# EAGLE design Minimum-System (EAGLE 6.3)
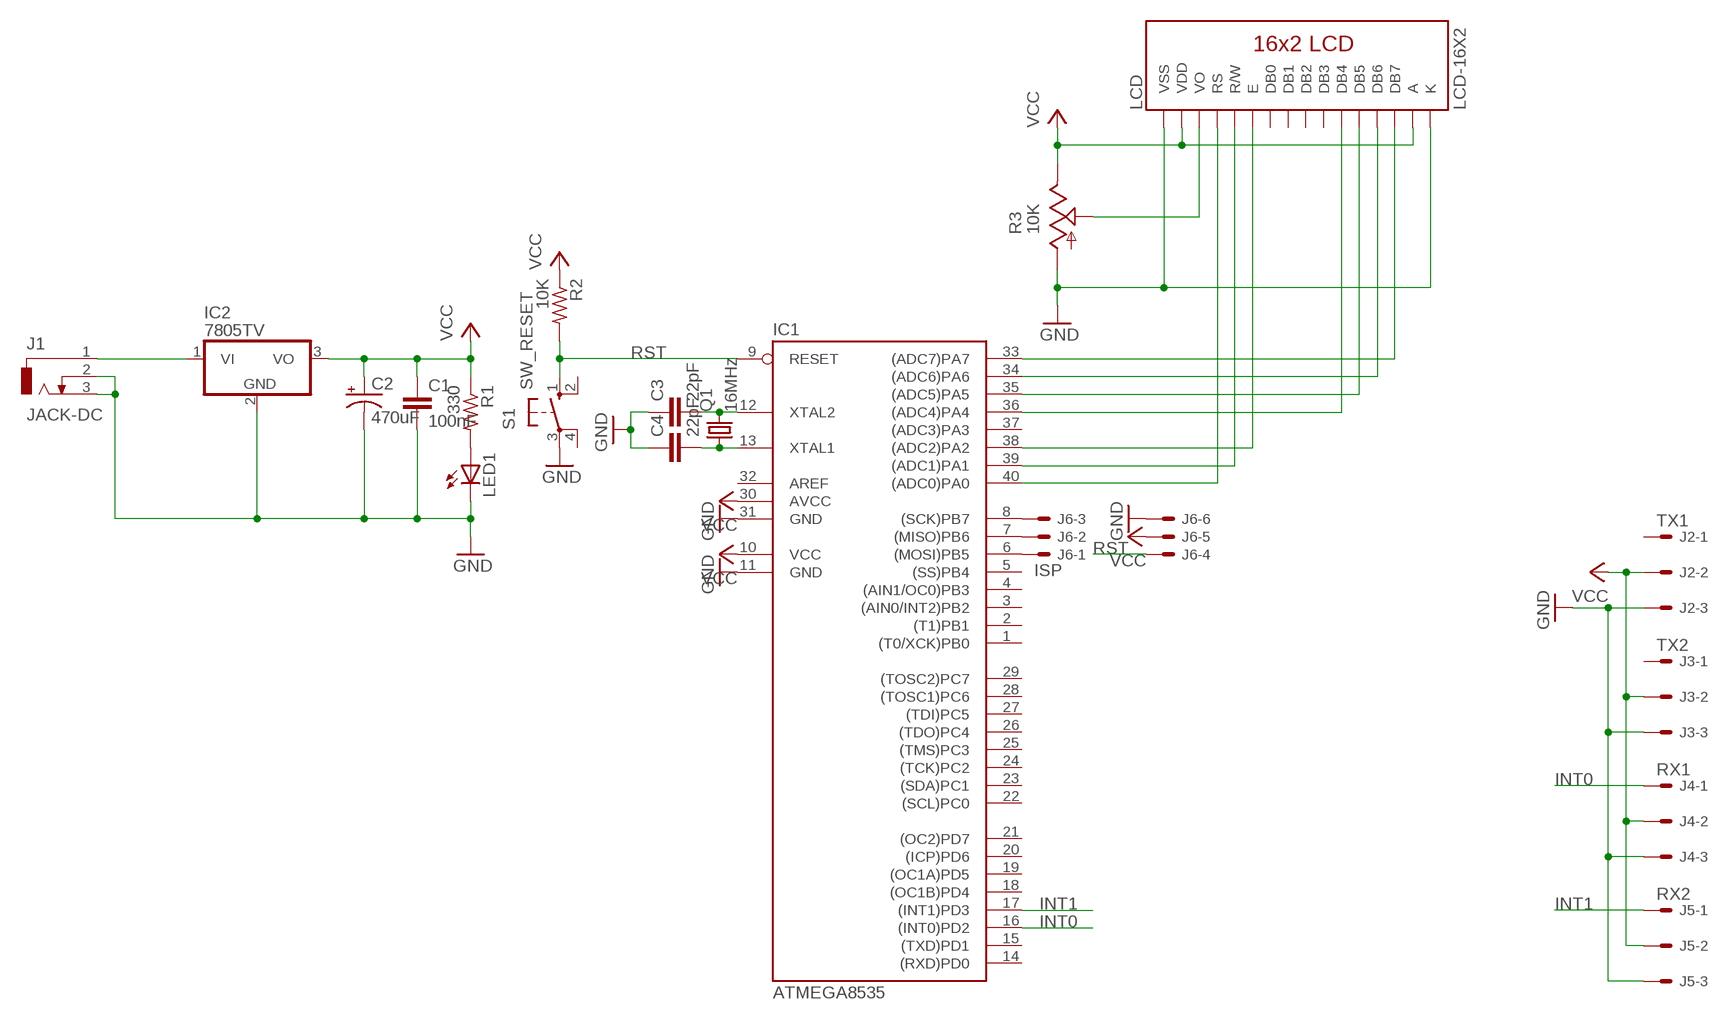
[diagram p0: schematic, sheet 1]

## Parts
C1  100nF  CAPACITOR-NONPOLAR025-024X044  [C025-024X044]
C2  470uF  CAPACITOR-POLARE2.5-6  [E2,5-6]
C3  22pF  CAPACITOR-NONPOLAR025-024X044  [C025-024X044]
C4  22pF  CAPACITOR-NONPOLAR025-024X044  [C025-024X044]
IC1  ATMEGA8535  ATMEGA8535/16/32  [DIL40]
IC2  7805TV  [TO220V]
J1  JACK-DC  [DCJ0202]
J2  TX1  CON_MOLEX-05-7038-03  [7395-03]
J3  TX2  CON_MOLEX-05-7038-03  [7395-03]
J4  RX1  CON_MOLEX-05-7038-03  [7395-03]
J5  RX2  CON_MOLEX-05-7038-03  [7395-03]
J6  ISP  CON_MOLEX-27-2061-06  [6410-06]
LCD  LCD-16X2  [LCD-16X2]
LED1  LED3MM  [LED3MM]
Q1  16MHz  CRYSTALHC49S  [HC49/S]
R1  330  RESISTOR0204/7  [0204/7]
R2  10K  RESISTOR0204/7  [0204/7]
R3  10K  TRIMPOTCA6V  [CA6V]
S1  SW_RESET  SW-PUSHBUTTON  [B3F-10XX]

## Nets
GND [pwr]: C1.2 C2.- C3.1 C4.1 IC1.11(GND) IC1.31(GND) IC2.2(GND) J1.2 J1.3 J2.3 J3.3 J4.3 J5.3 J6.6 LCD.1(VSS) LCD.16(K) LED1.K(C) R3.A S1.3(P)
INT0: IC1.16((INT0)PD2) J4.1
INT1: IC1.17((INT1)PD3) J5.1
N$1: LED1.A R1.2
N$2: IC1.34((ADC6)PA6) LCD.13(DB6)
N$3: IC1.33((ADC7)PA7) LCD.14(DB7)
N$4 [pwr]: IC2.1(VI) J1.1
N$5: C3.2 IC1.12(XTAL2) Q1.2
N$6: C4.2 IC1.13(XTAL1) Q1.1
N$7: LCD.3(VO) R3.S
N$9: IC1.40((ADC0)PA0) LCD.4(RS)
N$10: IC1.39((ADC1)PA1) LCD.5(R/W)
N$11: IC1.38((ADC2)PA2) LCD.6(E)
N$12: IC1.36((ADC4)PA4) LCD.11(DB4)
N$13: IC1.35((ADC5)PA5) LCD.12(DB5)
N$14: IC1.6((MOSI)PB5) J6.1
N$15: IC1.7((MISO)PB6) J6.2
N$16: IC1.8((SCK)PB7) J6.3
RST: IC1.9(RESET) J6.4 R2.2 S1.1(S)
VCC [pwr]: C1.1 C2.+ IC1.10(VCC) IC1.30(AVCC) IC2.3(VO) J2.2 J3.2 J4.2 J5.2 J6.5 LCD.2(VDD) LCD.15(A) R1.1 R2.1 R3.E
Unconnected: IC1.1((T0/XCK)PB0) IC1.2((T1)PB1) IC1.3((AIN0/INT2)PB2) IC1.4((AIN1/OC0)PB3) IC1.5((SS)PB4) IC1.14((RXD)PD0) IC1.15((TXD)PD1) IC1.18((OC1B)PD4) IC1.19((OC1A)PD5) IC1.20((ICP)PD6) IC1.21((OC2)PD7) IC1.22((SCL)PC0) IC1.23((SDA)PC1) IC1.24((TCK)PC2) IC1.25((TMS)PC3) IC1.26((TDO)PC4) IC1.27((TDI)PC5) IC1.28((TOSC1)PC6) IC1.29((TOSC2)PC7) IC1.32(AREF) IC1.37((ADC3)PA3) J2.1 J3.1 LCD.7(DB0) LCD.8(DB1) LCD.9(DB2) LCD.10(DB3) S1.2(S1) S1.4(P1)

## Library data of the parts
C1 C3 C4 = barelang-store:CAPACITOR-NONPOLAR: CAPACITOR, European symbol
C2 = barelang-store:CAPACITOR-POLAR: POLARIZED CAPACITOR, American symbol
IC1 = barelang-store:ATMEGA8535/16/32: MICROCONTROLLER 32 Kbytes FLASH 2 Kbytes SRAM 1 Kbytes EEPROM USART 8-channel 10 bit ADC Source: www.atmel.com .. doc2503.pdf; MPN: ATMEGA32-16PU; OC_FARNELL: 1661729; OC_NEWARK: 51P1794
IC2 = linear:78*: Positive VOLTAGE REGULATOR Source: http://cache.national.com/ds/LM/LM78L05.pdf http://www.fairchildsemi.com/ds/LM/LM7805.pdf
J1 = barelang-store:JACK-DC: DC POWER JACK Source: DCJ0202.pdf; OC_FARNELL: unknown; OC_NEWARK: unknown
J2-J5 = barelang-store:CON_MOLEX-?-03: CONNECTOR wire to board 2.54 mm (.1 inch) pitch header; OC_FARNELL: unknown; OC_NEWARK: unknown
J6 = barelang-store:CON_MOLEX-?-06: CONNECTOR wire to board 2.54 mm (.1 inch) pitch header; OC_FARNELL: unknown; OC_NEWARK: unknown
LCD = barelang-store:LCD-16X2
LED1 = barelang-store:LED: LED OSRAM: - CHIPLED LG R971, LG N971, LY N971, LG Q971, LY Q971, LO R971, LY R971 LH N974, LH R974 LS Q976, LO Q976, LY Q976 LO Q996 - Hyper CHIPLED LW Q18S LB Q993, LB Q99A, LB R99A - SideLED LS A670, LO A670, LY A670, LG A670, LP A670 LB A673, LV A673, LT A673, LW A673 LH A674 LY A675 LS A676, LA A676, LO A676, LY A676, LW A676 LS A679, LY A679, LG A679 - Hyper Micro SIDELED® LS Y876, LA Y876, LO Y876, LY Y876 LT Y87S - SmartLED LW L88C, LW L88S LB L89C, LB L89S, LG L890 LS L89K, LO L89K, LY L89K LS L896, LA L896, LO L896, LY L896 - TOPLED LS T670, LO T670, LY T670, LG T670, LP T670 LSG T670, LSP T670, LSY T670, LOP T670, LYG T670 LG T671, LOG T671, LSG T671 LB T673, LV T673, LT T673, LW T673 LH T674 LS T676, LA T676, LO T676, LY T676, LB T676, LH T676, LSB T676, LW T676 LB T67C, LV T67C, LT T67C, LS T67K, LO T67K, LY T67K, LW E67C LS E67B, LA E67B, LO E67B, LY E67B, LB E67C, LV E67C, LT E67C LW T67C LS T679, LY T679, LG T679 LS T770, LO T770, LY T770, LG T770, LP T770 LB T773, LV T773, LT T773, LW T773 LH T774 LS E675, LA E675, LY E675, LS T675 LS T776, LA T776, LO T776, LY T776, LB T776 LHGB T686 LT T68C, LB T68C - Hyper Mini TOPLED® LB M676 - Mini TOPLED Santana® LG M470 LS M47K, LO M47K, LY M47K Source: http://www.osram.convergy.de LUXEON: - LUMILED® LXK2-PW12-R00, LXK2-PW12-S00, LXK2-PW14-U00, LXK2-PW14-V00 LXK2-PM12-R00, LXK2-PM12-S00, LXK2-PM14-U00 LXK2-PE12-Q00, LXK2-PE12-R00, LXK2-PE12-S00, LXK2-PE14-T00, LXK2-PE14-U00 LXK2-PB12-K00, LXK2-PB12-L00, LXK2-PB12-M00, LXK2-PB14-N00, LXK2-PB14-P00, LXK2-PB14-Q00 LXK2-PR12-L00, LXK2-PR12-M00, LXK2-PR14-Q00, LXK2-PR14-R00 LXK2-PD12-Q00, LXK2-PD12-R00, LXK2-PD12-S00 LXK2-PH12-R00, LXK2-PH12-S00 LXK2-PL12-P00, LXK2-PL12-Q00, LXK2-PL12-R00 Source: www.luxeon.com KINGBRIGHT: KA-3528ASYC Source: www.kingbright.com
Q1 = barelang-store:CRYSTAL: CRYSTAL; OC_FARNELL: 1667008; OC_NEWARK: unknown
R1 R2 = barelang-store:RESISTOR: RESISTOR, American symbol
R3 = barelang-store:TRIMPOT: POTENTIOMETER
S1 = barelang-store:SW-PUSHBUTTON: OMRON SWITCH; MPN: B3F-1000; OC_FARNELL: 176432; OC_NEWARK: 36M3542

## Net classes
0 default: width 0.4 mm
1 pwr: width 0.5 mm

## Board
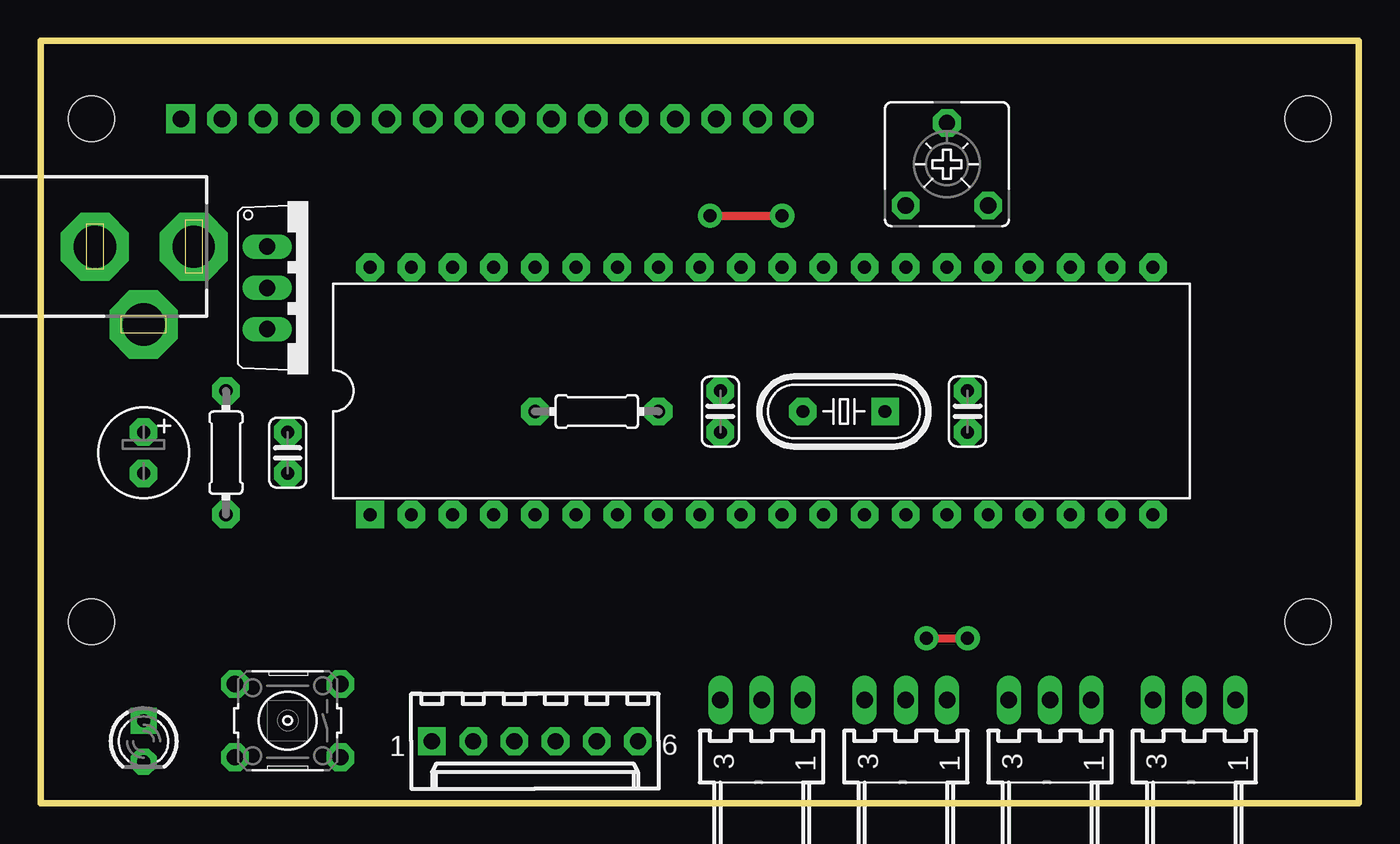
[diagram p1: board, top side]
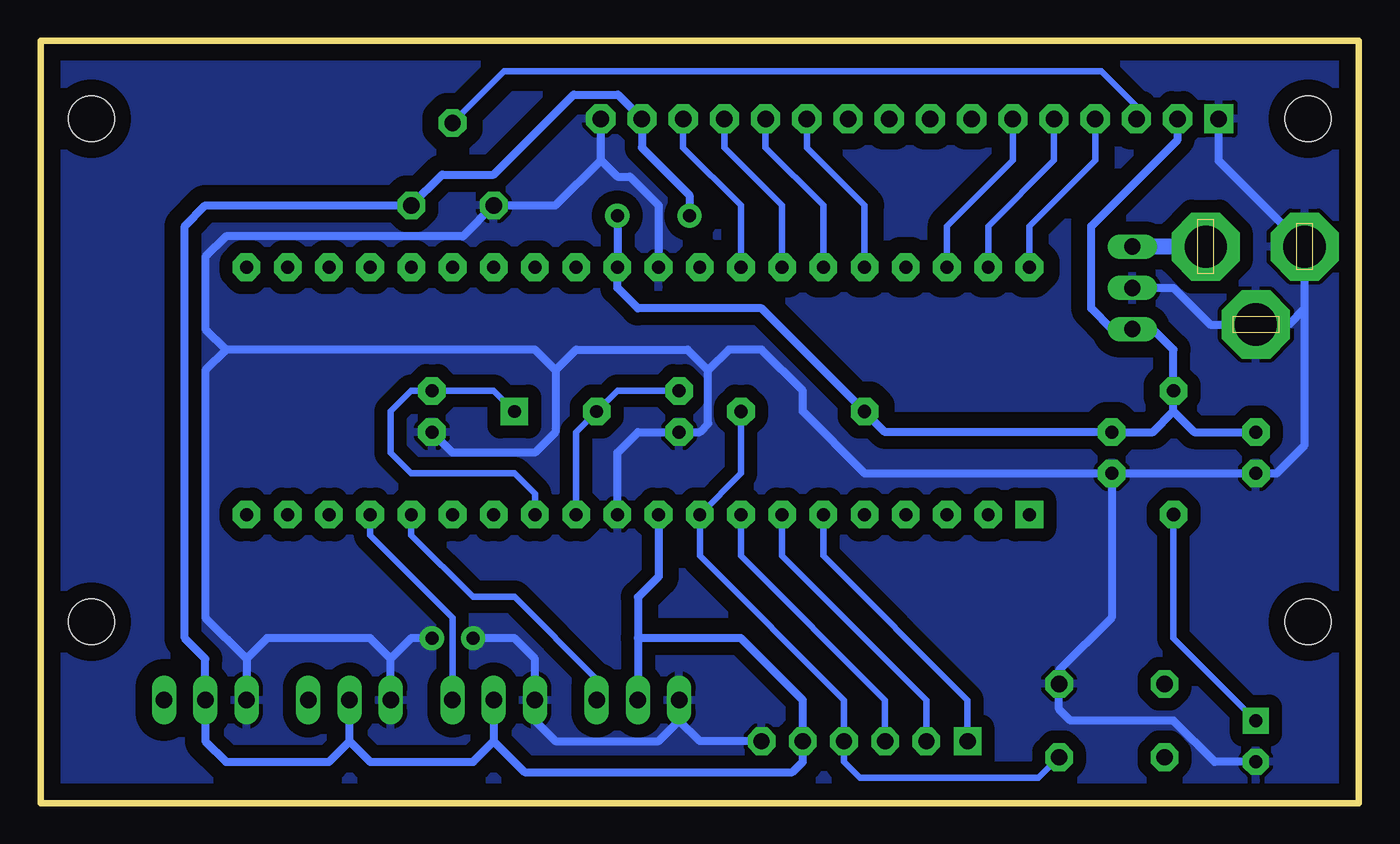
[diagram p2: board, bottom side, seen from below]

Size 81.28 x 46.99 mm. Coordinates in mm from the lower left corner, seen from the top.
Outline: 0,46.99 81.28,46.99 81.28,0 0,0 0,46.99
Copper layers (1*16): Top 0.035mm / dielectric 1.5mm / Bottom 0.035mm
Design rules "default": minimum track width 10mil, minimum drill 24mil, track to track 8mil, track to pad 8mil, pad to pad 8mil, via to via 8mil, smd to smd 8mil, copper to edge 40mil, drill to drill 8mil, minimum pad ring 10mil, minimum via ring 8mil, stop-mask expansion 4mil, vias tented up to drill 0mil, thermal gap 10mil

### Footprints (pad centres in the part's own frame; a part is rotated, then mirrored left to right if it is on the bottom)
C025-024X044 = drill 0.8 pad 1.7 octagon: 1 -1.27,0; 2 1.27,0
E2,5-6 = drill 0.8 pad 1.7 octagon: + -1.27,0; - 1.27,0
DIL40 = drill 0.8 pad 1.7 square: 1 -24.13,-7.62 | drill 0.8 pad 1.7 octagon: 2 -21.59,-7.62; 3 -19.05,-7.62; 4 -16.51,-7.62; 5 -13.97,-7.62; 6 -11.43,-7.62; 7 -8.89,-7.62; 8 -6.35,-7.62; 9 -3.81,-7.62; 10 -1.27,-7.62; 11 1.27,-7.62; 12 3.81,-7.62; 13 6.35,-7.62; 14 8.89,-7.62; 15 11.43,-7.62; 16 13.97,-7.62; 17 16.51,-7.62; 18 19.05,-7.62; 19 21.59,-7.62; 20 24.13,-7.62; 21 24.13,7.62; 22 21.59,7.62; 23 19.05,7.62; 24 16.51,7.62; 25 13.97,7.62; 26 11.43,7.62; 27 8.89,7.62; 28 6.35,7.62; 29 3.81,7.62; 30 1.27,7.62; 31 -1.27,7.62; 32 -3.81,7.62; 33 -6.35,7.62; 34 -8.89,7.62; 35 -11.43,7.62; 36 -13.97,7.62; 37 -16.51,7.62; 38 -19.05,7.62; 39 -21.59,7.62; 40 -24.13,7.62
TO220V = drill 1.016 long: 1 -2.54,-2.54; 2 0,-2.54; 3 2.54,-2.54
DCJ0202 = drill 2.6 pad 4.2 octagon: 1 0,3.1; 2 4.8,0; 3 0,-3
7395-03 = drill 1.016 long: 1 2.54,0; 2 0,0; 3 -2.54,0
6410-06 = drill 1 pad 1.7 square: 1 6.35,0 | drill 1 pad 1.7 octagon: 2 3.81,0; 3 1.27,0; 4 -1.27,0; 5 -3.81,0; 6 -6.35,0
LCD-16X2 = drill 1.016 pad 1.8 square: 1 -32,15.5 | drill 1.016 pad 1.8 octagon: 2 -29.46,15.5; 3 -26.92,15.5; 4 -24.38,15.5; 5 -21.84,15.5; 6 -19.3,15.5; 7 -16.76,15.5; 8 -14.22,15.5; 9 -11.68,15.5; 10 -9.14,15.5; 11 -6.6,15.5; 12 -4.06,15.5; 13 -1.52,15.5; 14 1.02,15.5; 15 3.56,15.5; 16 6.1,15.5 | hole 2.8: -37.5,15.5; -37.5,-15.5; 37.5,15.5; 37.5,-15.5
LED3MM = drill 0.8 pad 1.6 square: A -1.27,0 | drill 0.8 pad 1.6 octagon: K 1.27,0
HC49/S = drill 0.8 pad 1.7 square: 1 -2.54,0 | drill 0.8 pad 1.7 octagon: 2 2.54,0
0204/7 = drill 0.813 pad 1.7 octagon: 1 -3.81,0; 2 3.81,0
CA6V = drill 1 pad 1.7 octagon: A -2.54,-2.54; E 2.54,-2.54; S 0,2.54
B3F-10XX = drill 1 pad 1.7 octagon: 1 -3.251,2.261; 2 3.251,2.261; 3 -3.251,-2.261; 4 3.251,-2.261

### Placement (x,y rotation side)
C1  15.24,21.59 270 top
C2  6.35,21.59 270 top
C3  41.91,24.13 90 top
C4  57.15,24.13 90 top
IC1  44.45,25.4 0 top
IC2  16.51,31.75 270 top
J1  6.35,34.29 270 top
J2  71.12,6.35 0 top
J3  62.23,6.35 0 top
J4  44.45,6.35 0 top
J5  53.34,6.35 0 top
J6  30.48,3.81 180 top
LCD  40.64,26.67 0 top
LED1  6.35,3.81 270 top
Q1  49.53,24.13 180 top
R1  11.43,21.59 270 top
R2  34.29,24.13 0 top
R3  55.88,39.37 0 top
S1  15.24,5.08 180 top

### Tracks (layer width: path | path; a pad name or v marks a point on that pad's centre or on a via)
GND  (via drill 0.8 pad 1.5)
  Top 0.5: v54.61,10.16 v57.15,10.16
  Bottom 0.5: 69.85,27.94 71.12,26.67 71.12,11.43 68.58,8.89 | 69.85,27.94 71.12,29.21 71.12,33.66 69.85,34.92 55.25,34.92 R3.A 49.53,36.83 46.74,39.62 | 49.53,26.67 49.53,22.86 50.8,21.59 55.88,21.59 C4.1 | IC1.11 45.72,21.59 44.45,22.86 C3.1 40.64,22.86 40.12,23.38 40.12,26.67 | LCD.1 8.64,39.58 J1.3 3.35,30.48 | 46.74,39.62 LCD.16 | IC1.31 43.18,36.83 44.95,38.6 45.72,38.6 46.74,39.62 | 49.53,26.67 50.8,27.94 69.85,27.94 | C1.2 15.24,11.43 18.49,8.18 S1.3 18.49,5.79 17.78,5.08 11.43,5.08 8.89,2.54 LED1.K | 49.53,26.67 48.26,27.94 41.39,27.94 40.12,26.67 | 3.35,30.48 3.35,22.05 5.08,20.32 C2.- C1.2 | C1.2 30.48,20.32 34.29,24.13 34.29,25.4 36.83,27.94 38.85,27.94 40.12,26.67 | IC2.2 11.43,31.75 9.17,29.49 J1.2 4.34,29.49 3.35,30.48 | J6.6 40.64,3.81 41.91,5.08 | 41.91,5.08 J4.3 | 41.91,5.08 43.18,3.81 49.53,3.81 50.8,5.08 J5.3 50.8,8.89 52.07,10.16 v54.61,10.16 | J3.3 59.69,8.89 | 59.69,8.89 60.96,10.16 67.31,10.16 68.58,8.89 | 68.58,8.89 J2.3 | v57.15,10.16 58.42,10.16 59.69,8.89
  pour Bottom (isolate 0.8): 0,46.99 81.28,46.99 81.28,0 0,0
INT0
  Bottom 0.4: IC1.16 58.42,16.51 54.61,12.7 52.07,12.7 46.99,7.62 J4.1
INT1
  Bottom 0.4: IC1.17 60.96,16.51 55.88,11.43 J5.1
N$1
  Bottom 0.4: LED1.A 11.43,10.16 R1.2
N$2
  Bottom 0.4: IC1.34 35.56,36.83 39.12,40.39 LCD.13
N$3
  Bottom 0.4: IC1.33 38.1,36.83 41.66,40.39 LCD.14
N$4
  Bottom 1: J1.1 IC2.1
N$5
  Bottom 0.4: IC1.12 48.26,22.86 Q1.2 45.72,25.4 C3.2
N$6
  Bottom 0.4: Q1.1 53.34,25.4 C4.2 58.42,25.4 59.69,24.13 59.69,21.59 58.42,20.32 52.07,20.32 50.8,19.05 IC1.13
N$7
  Bottom 0.4: R3.S 52.71,45.08 15.88,45.08 13.72,42.93 LCD.3
N$8
  pour Bottom (isolate 1): 0,46.99 81.28,46.99 81.28,0 0,0
N$9
  Bottom 0.4: IC1.40 20.32,35.56 16.26,39.62 LCD.4
N$10
  Bottom 0.4: IC1.39 22.86,35.56 18.8,39.62 LCD.5
N$11
  Bottom 0.4: IC1.38 25.4,35.56 21.34,39.62 LCD.6
N$12
  Bottom 0.4: IC1.36 30.48,36.83 34.04,40.39 LCD.11
N$13
  Bottom 0.4: IC1.35 33.02,36.83 36.58,40.39 LCD.12
N$14
  Bottom 0.4: IC1.6 33.02,15.24 24.13,6.35 J6.1
N$15
  Bottom 0.4: IC1.7 35.56,15.24 26.67,6.35 J6.2
N$16
  Bottom 0.4: IC1.8 38.1,15.24 29.21,6.35 J6.3
RST
  Bottom 0.4: R2.2 38.1,20.32 IC1.9 40.64,15.24 31.75,6.35 J6.4 31.75,2.54 30.76,1.55 19.76,1.55 S1.1
VCC  (via drill 0.8 pad 1.5)
  Top 0.5: v41.28,36.19 v45.72,36.19
  Bottom 0.5: 62.23,3.81 63.5,2.54 69.85,2.54 71.12,3.81 J2.2 71.12,8.89 72.39,10.16 72.39,35.56 71.12,36.83 R3.E 56.52,38.73 53.34,38.73 48.41,43.66 45.69,43.66 LCD.15 44.2,40.39 41.28,37.47 v41.28,36.19 | 44.45,10.16 44.45,12.69 43.18,13.96 IC1.10 | 44.45,10.16 J4.2 | 62.23,3.81 J3.2 | C2.+ 10.16,22.86 11.43,24.13 | J5.2 53.34,3.81 | 11.43,24.13 12.7,22.86 C1.1 29.21,22.86 R2.1 36.83,30.48 44.45,30.48 45.72,31.75 IC1.30 v45.72,36.19 | 11.43,24.13 R1.1 11.43,27.94 12.7,29.21 IC2.3 15.24,29.21 16.51,30.48 16.51,35.56 11.18,40.89 LCD.2 | 44.45,10.16 38.1,10.16 34.29,6.35 J6.5 34.29,2.54 34.92,1.91 51.44,1.91 53.34,3.81 | 62.23,3.81 60.96,2.54 54.61,2.54 53.34,3.81